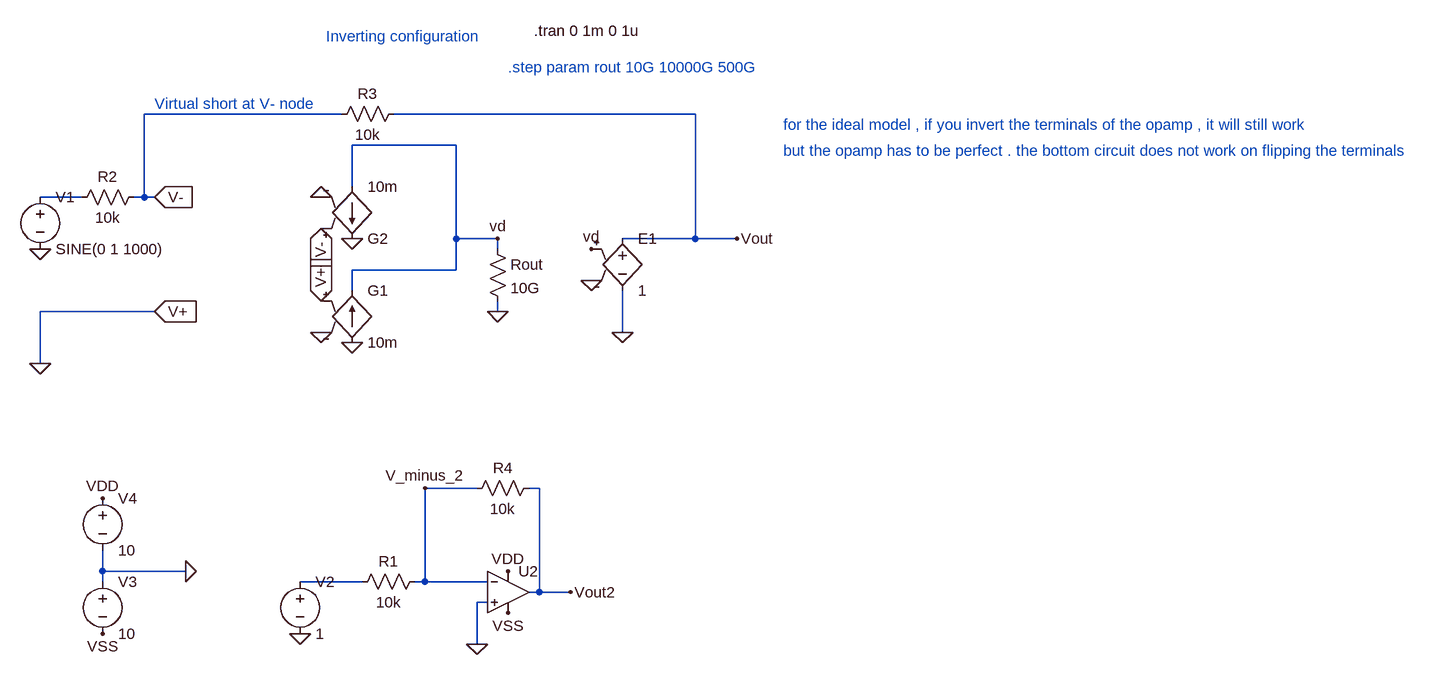
[diagram p0: schematic Inverting config.asc]
Inverting config.asc, the LTspice schematic file:
Version 4
SHEET 1 1748 1052
WIRE 0 -80 -304 -80
WIRE 544 -80 80 -80
WIRE 176 -32 16 -32
WIRE 16 32 16 -32
WIRE -400 48 -464 48
WIRE -304 48 -304 -80
WIRE -304 48 -320 48
WIRE -288 48 -304 48
WIRE 176 112 176 -32
WIRE 240 112 176 112
WIRE 544 112 544 -80
WIRE 544 112 432 112
WIRE 608 112 544 112
WIRE 240 128 240 112
WIRE 176 160 176 112
WIRE 176 160 16 160
WIRE 16 192 16 160
WIRE -288 224 -464 224
WIRE 240 224 240 208
WIRE 432 256 432 192
WIRE -464 304 -464 224
WIRE 208 496 128 496
WIRE 304 496 288 496
WIRE -368 624 -368 592
WIRE -240 624 -368 624
WIRE -368 640 -368 624
WIRE 32 640 -64 640
WIRE 128 640 128 496
WIRE 128 640 112 640
WIRE 224 640 128 640
WIRE 304 656 304 496
WIRE 304 656 288 656
WIRE 352 656 304 656
WIRE 224 672 208 672
WIRE 208 736 208 672
FLAG -32 48 0
FLAG -32 256 0
FLAG 16 112 0
FLAG 16 272 0
FLAG -288 48 V-
IOPIN -288 48 In
FLAG -32 96 V-
IOPIN -32 96 In
FLAG -288 224 V+
IOPIN -288 224 In
FLAG -32 208 V+
IOPIN -32 208 In
FLAG 608 112 Vout
FLAG -464 128 0
FLAG -464 304 0
FLAG 240 224 0
FLAG 432 256 0
FLAG 384 176 0
FLAG 384 128 vd
FLAG 240 112 vd
FLAG 208 736 0
FLAG -64 720 0
FLAG 352 656 Vout2
FLAG -240 624 0
FLAG -368 512 VDD
FLAG 256 624 VDD
FLAG -368 720 VSS
FLAG 256 688 VSS
FLAG 128 496 V_minus_2
SYMBOL g 16 176 R0
SYMATTR InstName G1
SYMATTR Value 10m
SYMBOL g 16 128 M180
SYMATTR InstName G2
SYMATTR Value 10m
SYMBOL voltage -464 32 R0
WINDOW 123 0 0 Left 0
WINDOW 39 0 0 Left 0
SYMATTR InstName V1
SYMATTR Value SINE(0 1 1000)
SYMBOL res 224 112 R0
SYMATTR InstName Rout
SYMATTR Value 10G
SYMBOL res -304 32 R90
WINDOW 0 0 56 VBottom 2
WINDOW 3 32 56 VTop 2
SYMATTR InstName R2
SYMATTR Value 10k
SYMBOL res 96 -96 R90
WINDOW 0 0 56 VBottom 2
WINDOW 3 32 56 VTop 2
SYMATTR InstName R3
SYMATTR Value 10k
SYMBOL e 432 96 R0
SYMATTR InstName E1
SYMATTR Value 1
SYMBOL res 128 624 R90
WINDOW 0 0 56 VBottom 2
WINDOW 3 32 56 VTop 2
SYMATTR InstName R1
SYMATTR Value 10k
SYMBOL res 304 480 R90
WINDOW 0 0 56 VBottom 2
WINDOW 3 32 56 VTop 2
SYMATTR InstName R4
SYMATTR Value 10k
SYMBOL voltage -64 624 R0
WINDOW 123 0 0 Left 0
WINDOW 39 0 0 Left 0
SYMATTR InstName V2
SYMATTR Value 1
SYMBOL Opamps\\UniversalOpamp2 256 656 R0
SYMATTR InstName U2
SYMBOL voltage -368 624 R0
WINDOW 123 0 0 Left 0
WINDOW 39 0 0 Left 0
SYMATTR InstName V3
SYMATTR Value 10
SYMBOL voltage -368 496 R0
WINDOW 123 0 0 Left 0
WINDOW 39 0 0 Left 0
SYMATTR InstName V4
SYMATTR Value 10
TEXT 296 -208 Left 2 !.tran 0 1m 0 1u
TEXT -24 -200 Left 2 ;Inverting configuration
TEXT -288 -96 Left 2 ;Virtual short at V- node
TEXT 256 -152 Left 2 ;.step param rout 10G 10000G 500G
TEXT 680 -64 Left 2 ;for the ideal model , if you invert the terminals of the opamp , it will still work
TEXT 680 -24 Left 2 ;but the opamp has to be perfect . the bottom circuit does not work on flipping the terminals

The netlist it stands for:
* Inverting config.asc
G1 0 vd 0 0 10m
G2 vd 0 V- 0 10m
V1 N001 0 SINE(0 1 1000)
Rout vd 0 10G
R2 V- N001 10k
R3 Vout V- 10k
E1 Vout 0 vd 0 1
R1 V_minus_2 N002 10k
R4 Vout2 V_minus_2 10k
V2 N002 0 1
XU2 0 V_minus_2 VDD VSS Vout2 level.2 Avol=1Meg GBW=10Meg Slew=10Meg ilimit=25m rail=0 Vos=0 phimargin=45 en=0 enk=0 in=0 ink=0 Rin=500Meg  ; pins IN+ IN- V+ V- OUT
V3 0 VSS 10
V4 VDD 0 10
.tran 0 1m 0 1u
* Inverting configuration
* Virtual short at V- node
* .step param rout 10G 10000G 500G
* for the ideal model , if you invert the terminals of the opamp , it will still work
* but the opamp has to be perfect . the bottom circuit does not work on flipping the terminals
.lib UniversalOpamps2.sub
.backanno
.end